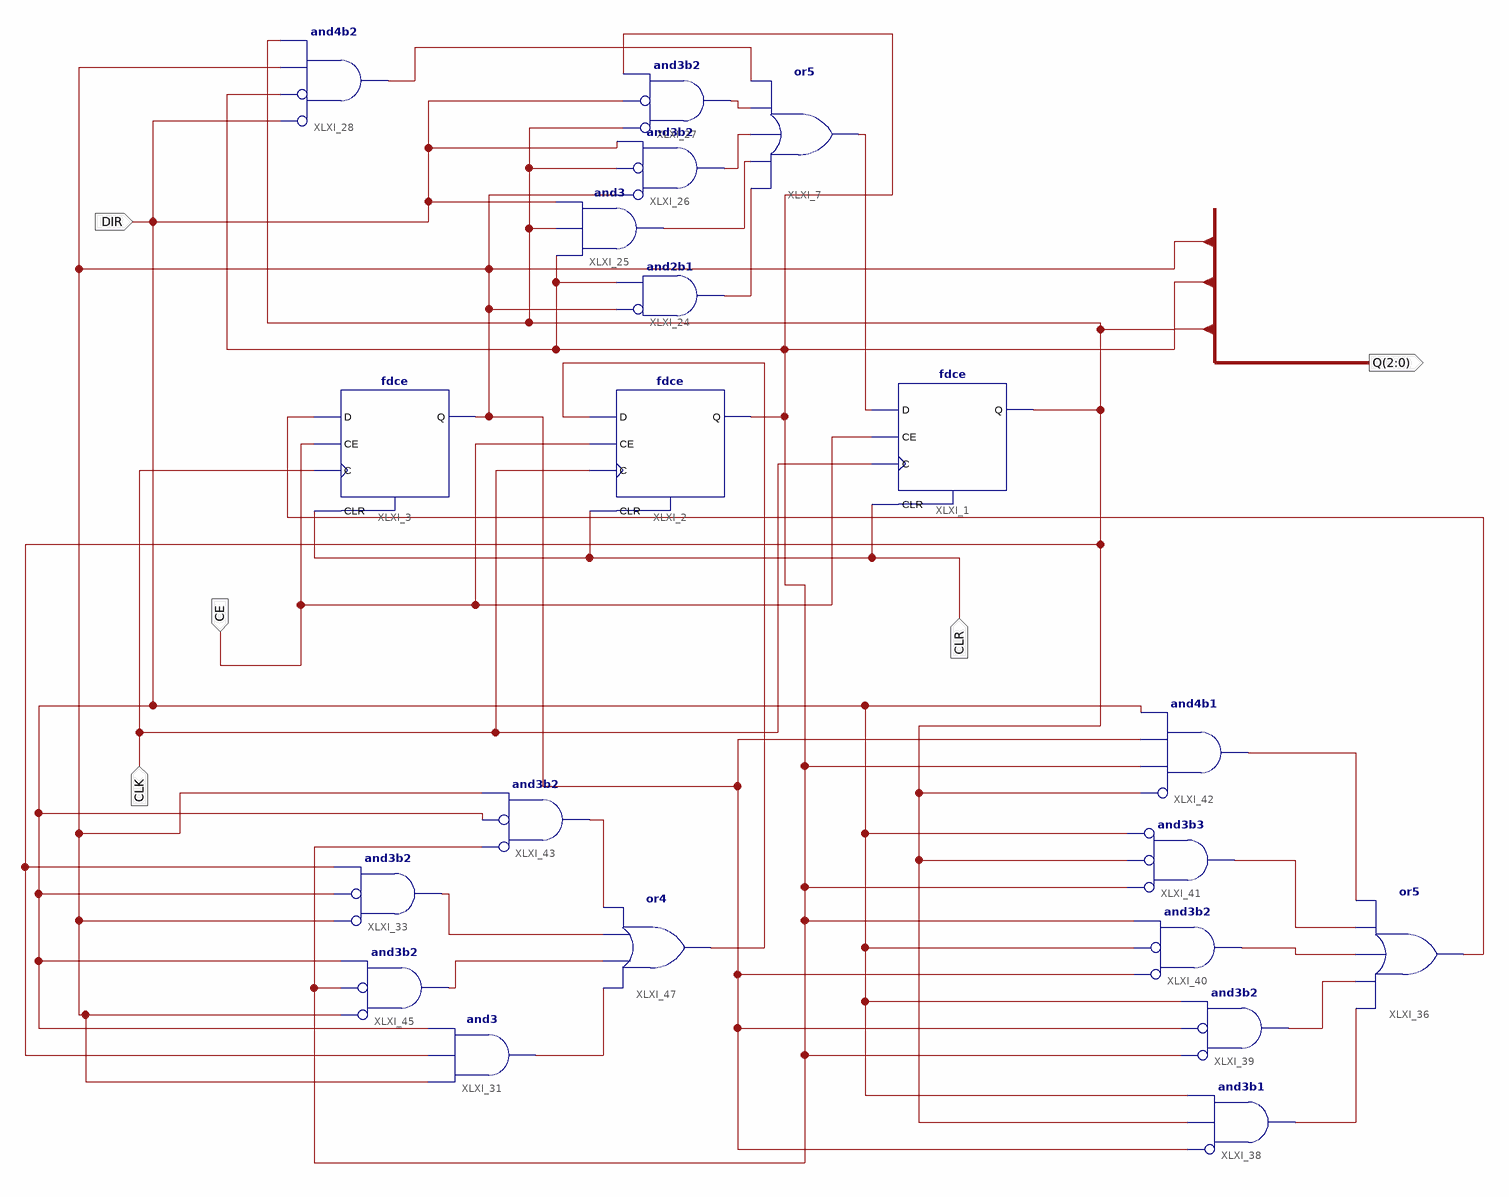
[diagram p0: schematic sheet 1]
// Xilinx ISE schematic Z1.sch (xc9500xl) as structural Verilog: 20 symbols, 5 ports
module Z1 (
  input  CLK,
  input  CE,
  input  CLR,
  input  DIR,
  output [2:0] Q
);

  wire XLXN_35, XLXN_36, XLXN_41, XLXN_66, XLXN_77, XLXN_78, XLXN_82, XLXN_83, XLXN_84, XLXN_103, XLXN_104,
       XLXN_105, XLXN_106, XLXN_107, XLXN_108, XLXN_124, XLXN_125;

  fdce XLXI_1 (.C(CLK), .CE(CE), .CLR(CLR), .D(XLXN_35), .Q(Q[2]));
  fdce XLXI_2 (.C(CLK), .CE(CE), .CLR(CLR), .D(XLXN_125), .Q(Q[1]));
  fdce XLXI_3 (.C(CLK), .CE(CE), .CLR(CLR), .D(XLXN_108), .Q(Q[0]));
  or XLXI_7 (XLXN_35, XLXN_36, XLXN_66, XLXN_41, XLXN_77, XLXN_78);
  and XLXI_24 (XLXN_36, ~Q[0], Q[1]);  // and2b1
  and XLXI_25 (XLXN_66, Q[1], Q[2], DIR);
  and XLXI_26 (XLXN_41, ~Q[0], ~Q[2], DIR);  // and3b2
  and XLXI_27 (XLXN_77, ~Q[2], ~DIR, Q[1]);  // and3b2
  and XLXI_28 (XLXN_78, ~DIR, ~Q[1], Q[0], Q[2]);  // and4b2
  and XLXI_31 (XLXN_84, Q[0], Q[2], DIR);
  and XLXI_33 (XLXN_82, ~Q[0], ~DIR, Q[2]);  // and3b2
  or XLXI_36 (XLXN_108, XLXN_107, XLXN_106, XLXN_105, XLXN_104, XLXN_103);
  and XLXI_38 (XLXN_107, ~Q[0], Q[2], DIR);  // and3b1
  and XLXI_39 (XLXN_106, ~Q[1], ~Q[0], DIR);  // and3b2
  and XLXI_40 (XLXN_105, ~Q[0], ~DIR, Q[1]);  // and3b2
  and XLXI_41 (XLXN_104, ~Q[1], ~Q[2], ~DIR);  // and3b3
  and XLXI_42 (XLXN_103, ~Q[2], Q[1], Q[0], DIR);  // and4b1
  and XLXI_43 (XLXN_124, ~Q[1], ~DIR, Q[0]);  // and3b2
  and XLXI_45 (XLXN_83, ~Q[0], ~Q[1], DIR);  // and3b2
  or XLXI_47 (XLXN_125, XLXN_84, XLXN_83, XLXN_82, XLXN_124);
endmodule
